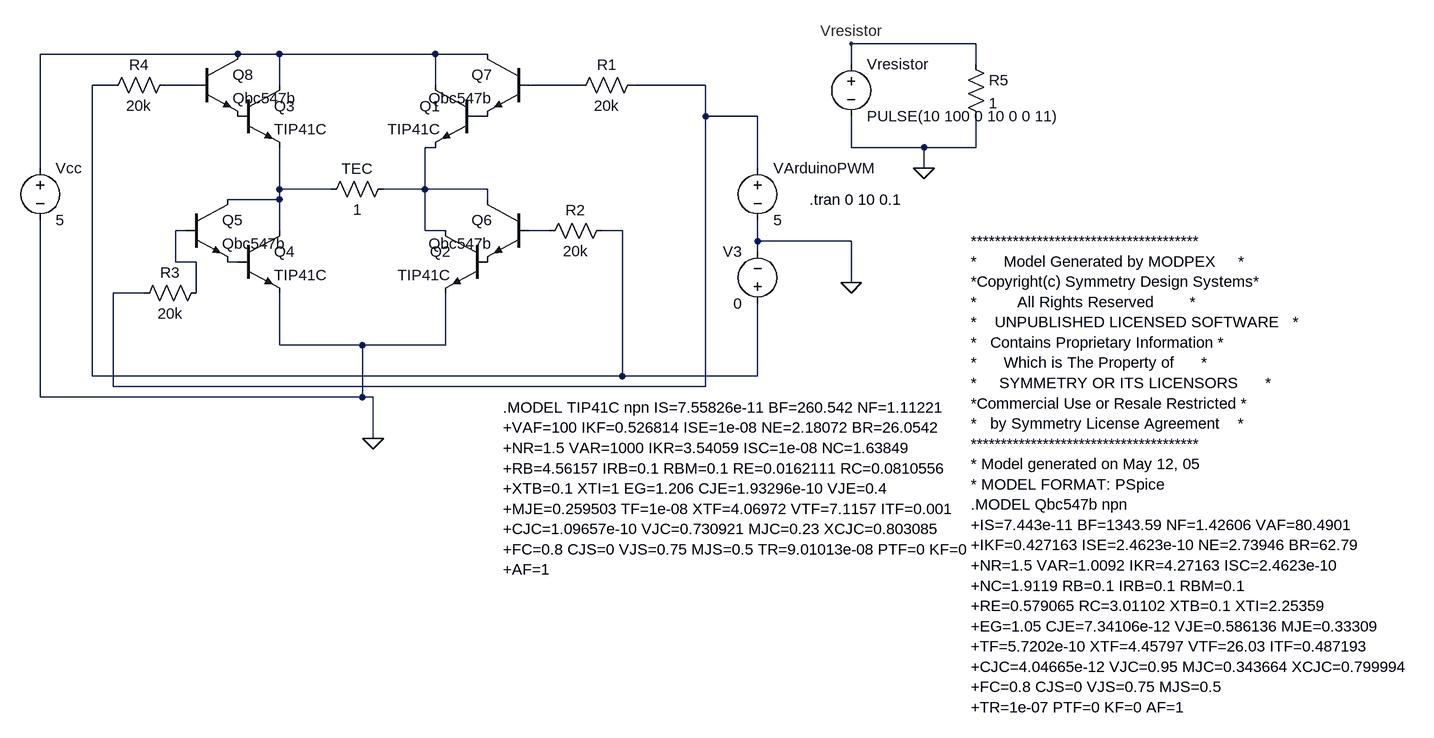
[diagram p0: schematic H-bridge-Darlington.asc]
H-bridge-Darlington.asc, the LTspice schematic file:
Version 4
SHEET 1 1912 840
WIRE 1232 16 1040 16
WIRE 96 32 -208 32
WIRE 160 32 96 32
WIRE 400 32 160 32
WIRE 480 32 400 32
WIRE 1040 48 1040 16
WIRE 1232 48 1232 16
WIRE -96 80 -128 80
WIRE 32 80 -16 80
WIRE 160 80 160 32
WIRE 400 80 400 32
WIRE 624 80 544 80
WIRE 816 80 704 80
WIRE 480 128 464 128
WIRE 816 128 816 80
WIRE 896 128 816 128
WIRE 400 176 384 176
WIRE 1040 176 1040 128
WIRE 1152 176 1040 176
WIRE 1232 176 1232 128
WIRE 1232 176 1152 176
WIRE -208 208 -208 32
WIRE 896 208 896 128
WIRE 1152 208 1152 176
WIRE 160 240 160 176
WIRE 240 240 160 240
WIRE 384 240 384 176
WIRE 384 240 320 240
WIRE 480 240 384 240
WIRE 160 256 160 240
WIRE 160 256 80 256
WIRE 480 256 480 240
WIRE 16 304 0 304
WIRE 160 304 160 256
WIRE 384 304 384 240
WIRE 416 304 384 304
WIRE 576 304 544 304
WIRE 688 304 656 304
WIRE 896 320 896 288
WIRE 1040 320 896 320
WIRE 896 336 896 320
WIRE 0 352 0 304
WIRE 32 352 0 352
WIRE 96 352 80 352
WIRE 1040 384 1040 320
WIRE -48 400 -96 400
WIRE 32 400 32 352
WIRE 160 480 160 400
WIRE 288 480 160 480
WIRE 416 480 416 400
WIRE 416 480 288 480
WIRE -128 528 -128 80
WIRE 688 528 688 304
WIRE 688 528 -128 528
WIRE 896 528 896 416
WIRE 896 528 688 528
WIRE -96 544 -96 400
WIRE 816 544 816 128
WIRE 816 544 -96 544
WIRE -208 560 -208 288
WIRE 288 560 288 480
WIRE 288 560 -208 560
WIRE 304 560 288 560
WIRE 304 624 304 560
FLAG 304 624 0
FLAG 1040 384 0
FLAG 1152 208 0
FLAG 1040 16 Vresistor
SYMBOL npn 464 80 M0
SYMATTR InstName Q1
SYMATTR Value TIP41C
SYMBOL npn 480 304 M0
SYMATTR InstName Q2
SYMATTR Value TIP41C
SYMBOL npn 96 80 R0
SYMATTR InstName Q3
SYMATTR Value TIP41C
SYMBOL npn 96 304 R0
SYMATTR InstName Q4
SYMATTR Value TIP41C
SYMBOL res 336 224 R90
WINDOW 0 0 56 VBottom 2
WINDOW 3 32 56 VTop 2
SYMATTR InstName TEC
SYMATTR Value 1
SYMBOL voltage -208 192 R0
SYMATTR InstName Vcc
SYMATTR Value 5
SYMBOL res 48 384 R90
WINDOW 0 0 56 VBottom 2
WINDOW 3 32 56 VTop 2
SYMATTR InstName R3
SYMATTR Value 20k
SYMBOL voltage 896 192 R0
SYMATTR InstName VArduinoPWM
SYMATTR Value 5
SYMBOL voltage 896 432 R180
WINDOW 0 24 96 Left 2
WINDOW 3 24 16 Left 2
SYMATTR InstName V3
SYMATTR Value 0
SYMBOL npn 16 256 R0
SYMATTR InstName Q5
SYMATTR Value Qbc547b
SYMBOL npn 544 256 M0
SYMATTR InstName Q6
SYMATTR Value Qbc547b
SYMBOL npn 544 32 M0
SYMATTR InstName Q7
SYMATTR Value Qbc547b
SYMBOL npn 32 32 R0
SYMATTR InstName Q8
SYMATTR Value Qbc547b
SYMBOL res 720 64 R90
WINDOW 0 0 56 VBottom 2
WINDOW 3 32 56 VTop 2
SYMATTR InstName R1
SYMATTR Value 20k
SYMBOL res 672 288 R90
WINDOW 0 0 56 VBottom 2
WINDOW 3 32 56 VTop 2
SYMATTR InstName R2
SYMATTR Value 20k
SYMBOL res 0 64 R90
WINDOW 0 0 56 VBottom 2
WINDOW 3 32 56 VTop 2
SYMATTR InstName R4
SYMATTR Value 20k
SYMBOL res 1216 32 R0
SYMATTR InstName R5
SYMATTR Value 1
SYMBOL voltage 1040 32 R0
SYMATTR InstName Vresistor
SYMATTR Value PULSE(10 100 0 10 0 0 11)
TEXT 976 256 Left 2 !.tran 0 10 0.1
TEXT 504 576 Left 2 !.MODEL TIP41C npn IS=7.55826e-11 BF=260.542 NF=1.11221\n+VAF=100 IKF=0.526814 ISE=1e-08 NE=2.18072 BR=26.0542\n+NR=1.5 VAR=1000 IKR=3.54059 ISC=1e-08 NC=1.63849\n+RB=4.56157 IRB=0.1 RBM=0.1 RE=0.0162111 RC=0.0810556\n+XTB=0.1 XTI=1 EG=1.206 CJE=1.93296e-10 VJE=0.4\n+MJE=0.259503 TF=1e-08 XTF=4.06972 VTF=7.1157 ITF=0.001\n+CJC=1.09657e-10 VJC=0.730921 MJC=0.23 XCJC=0.803085\n+FC=0.8 CJS=0 VJS=0.75 MJS=0.5 TR=9.01013e-08 PTF=0 KF=0\n+AF=1
TEXT 1224 320 Left 2 !**************************************\n*      Model Generated by MODPEX     *\n*Copyright(c) Symmetry Design Systems*\n*         All Rights Reserved        *\n*    UNPUBLISHED LICENSED SOFTWARE   *\n*   Contains Proprietary Information *\n*      Which is The Property of      *\n*     SYMMETRY OR ITS LICENSORS      *\n*Commercial Use or Resale Restricted *\n*   by Symmetry License Agreement    *\n**************************************\n* Model generated on May 12, 05\n* MODEL FORMAT: PSpice\n.MODEL Qbc547b npn\n+IS=7.443e-11 BF=1343.59 NF=1.42606 VAF=80.4901\n+IKF=0.427163 ISE=2.4623e-10 NE=2.73946 BR=62.79\n+NR=1.5 VAR=1.0092 IKR=4.27163 ISC=2.4623e-10\n+NC=1.9119 RB=0.1 IRB=0.1 RBM=0.1\n+RE=0.579065 RC=3.01102 XTB=0.1 XTI=2.25359\n+EG=1.05 CJE=7.34106e-12 VJE=0.586136 MJE=0.33309\n+TF=5.7202e-10 XTF=4.45797 VTF=26.03 ITF=0.487193\n+CJC=4.04665e-12 VJC=0.95 MJC=0.343664 XCJC=0.799994\n+FC=0.8 CJS=0 VJS=0.75 MJS=0.5\n+TR=1e-07 PTF=0 KF=0 AF=1

The netlist it stands for:
* H-bridge-Darlington.asc
Q1 N001 N006 N007 0 TIP41C
Q2 N007 P001 0 0 TIP41C
Q3 N001 P002 N008 0 TIP41C
Q4 N008 N011 0 0 TIP41C
R§TEC N007 N008 1
Vcc N001 0 5
R3 N009 N005 20k
VArduinoPWM N005 0 5
V3 N002 0 0
Q5 N008 N009 N011 0 Qbc547b
Q6 N007 N010 P001 0 Qbc547b
Q7 N001 N004 N006 0 Qbc547b
Q8 N001 N003 P002 0 Qbc547b
R1 N005 N004 20k
R2 N002 N010 20k
R4 N003 N002 20k
R5 Vresistor 0 1
Vresistor Vresistor 0 PULSE(10 100 0 10 0 0 11)
.model NPN NPN
.model PNP PNP
.lib standard.bjt
.tran 0 10 0.1
.MODEL TIP41C npn IS=7.55826e-11 BF=260.542 NF=1.11221
+VAF=100 IKF=0.526814 ISE=1e-08 NE=2.18072 BR=26.0542
+NR=1.5 VAR=1000 IKR=3.54059 ISC=1e-08 NC=1.63849
+RB=4.56157 IRB=0.1 RBM=0.1 RE=0.0162111 RC=0.0810556
+XTB=0.1 XTI=1 EG=1.206 CJE=1.93296e-10 VJE=0.4
+MJE=0.259503 TF=1e-08 XTF=4.06972 VTF=7.1157 ITF=0.001
+CJC=1.09657e-10 VJC=0.730921 MJC=0.23 XCJC=0.803085
+FC=0.8 CJS=0 VJS=0.75 MJS=0.5 TR=9.01013e-08 PTF=0 KF=0
+AF=1
**************************************
*      Model Generated by MODPEX     *
*Copyright(c) Symmetry Design Systems*
*         All Rights Reserved        *
*    UNPUBLISHED LICENSED SOFTWARE   *
*   Contains Proprietary Information *
*      Which is The Property of      *
*     SYMMETRY OR ITS LICENSORS      *
*Commercial Use or Resale Restricted *
*   by Symmetry License Agreement    *
**************************************
* Model generated on May 12, 05
* MODEL FORMAT: PSpice
.MODEL Qbc547b npn
+IS=7.443e-11 BF=1343.59 NF=1.42606 VAF=80.4901
+IKF=0.427163 ISE=2.4623e-10 NE=2.73946 BR=62.79
+NR=1.5 VAR=1.0092 IKR=4.27163 ISC=2.4623e-10
+NC=1.9119 RB=0.1 IRB=0.1 RBM=0.1
+RE=0.579065 RC=3.01102 XTB=0.1 XTI=2.25359
+EG=1.05 CJE=7.34106e-12 VJE=0.586136 MJE=0.33309
+TF=5.7202e-10 XTF=4.45797 VTF=26.03 ITF=0.487193
+CJC=4.04665e-12 VJC=0.95 MJC=0.343664 XCJC=0.799994
+FC=0.8 CJS=0 VJS=0.75 MJS=0.5
+TR=1e-07 PTF=0 KF=0 AF=1
.backanno
.end